# EAGLE schematic DMB-4771-Relais (EAGLE 6.5.0)
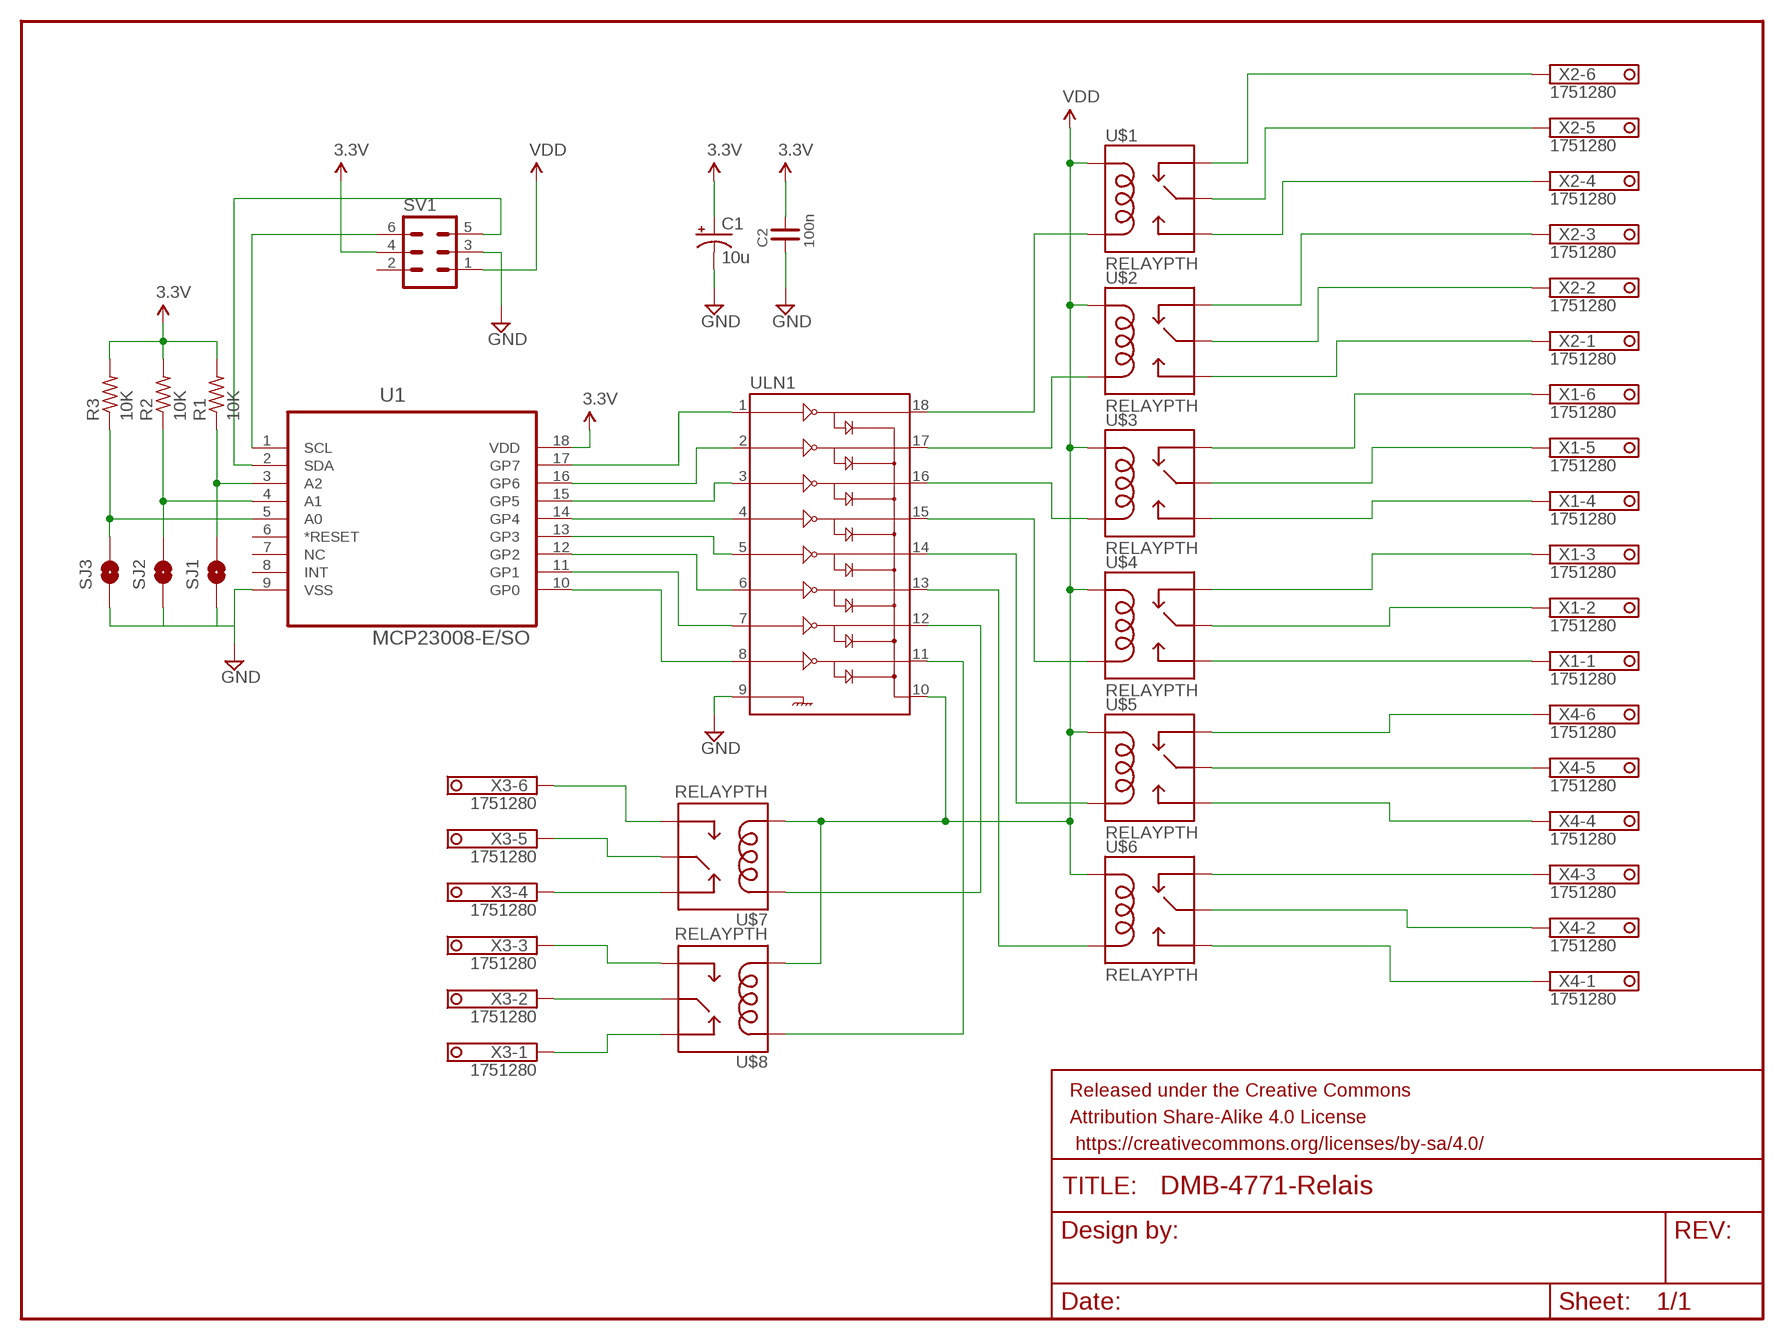
[diagram p0: schematic, sheet 1]

## Parts
C1  10u  CAP_POL1206  [EIA3216]
C2  100n  C0805  [C0805]
FRAME1  FRAME-LETTER  [CREATIVE_COMMONS]
R1  10K  R-US_R0805  [R0805]
R2  10K  R-US_R0805  [R0805]
R3  10K  R-US_R0805  [R0805]
SJ1  JUMPER-PAD-2-NOYES_SILK  [PAD-JUMPER-2-NO_YES_SILK]
SJ2  JUMPER-PAD-2-NOYES_SILK  [PAD-JUMPER-2-NO_YES_SILK]
SJ3  JUMPER-PAD-2-NOYES_SILK  [PAD-JUMPER-2-NO_YES_SILK]
SV1  ML6  [ML6]
U1  MCP23008-E/SO  [SOIC127P1030X265-18N]
U$1  RELAYPTH  [RELAY-G5Q]
U$2  RELAYPTH  [RELAY-G5Q]
U$3  RELAYPTH  [RELAY-G5Q]
U$4  RELAYPTH  [RELAY-G5Q]
U$5  RELAYPTH  [RELAY-G5Q]
U$6  RELAYPTH  [RELAY-G5Q]
U$7  RELAYPTH  [RELAY-G5Q]
U$8  RELAYPTH  [RELAY-G5Q]
ULN1  ULN2803SOIC  [SO018]
X1  1751280  [1751280]
X2  1751280  [1751280]
X3  1751280  [1751280]
X4  1751280  [1751280]

## Nets
3.3V: C1.A(+) C2.2 R1.2 R2.2 R3.2 SV1.4 U1.18(VDD)
GND: C1.C(-) C2.1 SJ1.1 SJ2.1 SJ3.1 SV1.3 U1.9(VSS) ULN1.9
N$1: U1.10(GP0) ULN1.8
N$2: U1.11(GP1) ULN1.7
N$3: U1.12(GP2) ULN1.6
N$4: U1.13(GP3) ULN1.5
N$5: U1.14(GP4) ULN1.4
N$6: U1.15(GP5) ULN1.3
N$7: U1.16(GP6) ULN1.2
N$8: U1.17(GP7) ULN1.1
N$9: U$1.1(COIL2) ULN1.18
N$10: U$2.1(COIL2) ULN1.17
N$11: U$3.1(COIL2) ULN1.16
N$12: U$4.1(COIL2) ULN1.15
N$13: U$5.1(COIL2) ULN1.14
N$14: U$6.1(COIL2) ULN1.13
N$15: U$7.5(COIL1) ULN1.12
N$16: U$8.5(COIL1) ULN1.11
N$17: SV1.5 U1.2(SDA)
N$18: R1.1 SJ1.2 U1.3(A2)
N$19: R3.1 SJ3.2 U1.5(A0)
N$20: SV1.6 U1.1(SCL)
N$21: U$1.4(NC) X2.6
N$22: U$1.2(MAIN) X2.5
N$23: U$2.4(NC) X2.3
N$24: R2.1 SJ2.2 U1.4(A1)
N$25: U$2.2(MAIN) X2.2
N$26: U$2.3(NO) X2.1
N$27: U$3.4(NC) X1.6
N$28: U$3.2(MAIN) X1.5
N$29: U$3.3(NO) X1.4
N$30: U$4.4(NC) X1.3
N$31: U$4.2(MAIN) X1.2
N$32: U$4.3(NO) X1.1
N$33: U$1.3(NO) X2.4
N$34: U$7.3(NO) X3.6
N$35: U$7.2(MAIN) X3.5
N$36: U$7.4(NC) X3.4
N$37: U$8.2(MAIN) X3.2
N$38: U$8.3(NO) X3.3
N$39: U$8.4(NC) X3.1
N$40: U$5.2(MAIN) X4.5
N$41: U$6.3(NO) X4.1
N$42: U$6.2(MAIN) X4.2
N$43: U$6.4(NC) X4.3
N$44: U$5.3(NO) X4.4
N$45: U$5.4(NC) X4.6
VDD: SV1.1 U$1.5(COIL1) U$2.5(COIL1) U$3.5(COIL1) U$4.5(COIL1) U$5.5(COIL1) U$6.5(COIL1) U$7.1(COIL2) U$8.1(COIL2) ULN1.10
Unconnected: SV1.2 U1.6(*RESET) U1.7(NC) U1.8(INT)

## Library data of the parts
C1 = SparkFun-Passives:CAP_POL: Capacitor Polarized These are standard SMD and PTH capacitors. Normally 10uF, 47uF, and 100uF in electrolytic and tantalum varieties. Always verify the external diameter of the through hole cap, it varies with capacity, voltage, and manufacturer. The EIA devices should be standard.
C2 = divers:C: Capacitor bipolar
FRAME1 = SparkFun-Aesthetics:FRAME-LETTER: Schematic Frame Standard 8.5x11 US Letter frame
R1-R3 = resistor:R-US_: RESISTOR, American symbol
SJ1-SJ3 = SparkFun-Passives:JUMPER-PAD-2-NO
SV1 = con-harting-ml:ML6: HARTING; OC_FARNELL: unknown; OC_NEWARK: unknown
U1 = Microchip_By_element14_Batch_1:MCP23008-E/SO: 8BIT EXPANDER, I/O, I2C I/F; MPN: MCP23008-E/SO; OC_FARNELL: 1332086; OC_NEWARK: 08J8738; PACKAGE: SOIC-18 -Wide; SUPPLIER: Microchip
U$1-U$8 = SparkFun-Electromechanical:RELAY: SPDT relay (COM-00101)
ULN1 = SparkFun-PowerIC:ULN2803: Darlington Driver ULN2803 Darlington array. 500mA max per channel, 8-channel package. Spark Fun Electronics SKU : COM-00312
X1-X4 = con-phoenix-350:1751280: MKDS 1/ 6-3,5 Printklemme Nennstrom: 10 A Bemessungsspannung: 160 V Raster: 3,5 mm Polzahl: 6 Montageart: Löten Anschlussart: Schraubanschluss Anschlussrichtung vom Leiter zur Platine: 0° Source: http://eshop.phoenixcontact.com .. 1751280.pdf; MPN: 1751280; OC_FARNELL: unknown; OC_NEWARK: 27R1765